# EAGLE design SOIC16 (EAGLE 6.0)
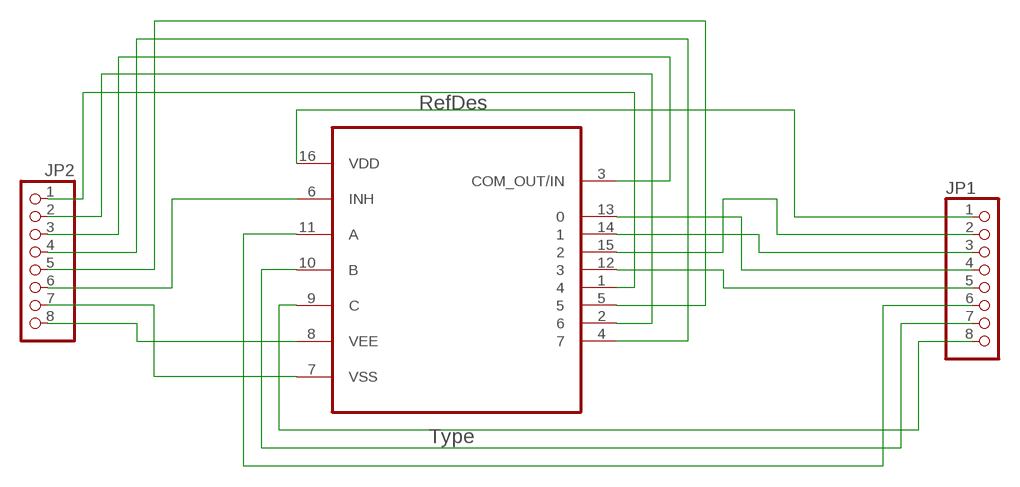
[diagram p0: schematic, sheet 1]

## Parts
JP1  PINHD-1X8  [1X08]
JP2  PINHD-1X8  [1X08]
U1  CD4051BM  [SOIC127P600X175-16N]

## Nets
N$1: JP2.1 U1.1
N$2: JP2.2 U1.2
N$3: JP2.3 U1.3(COM_OUT/IN)
N$4: JP2.4 U1.4
N$5: JP2.5 U1.5
N$6: JP2.6 U1.6(INH)
N$7: JP2.7 U1.7(VSS)
N$8: JP2.8 U1.8(VEE)
N$9: JP1.8 U1.9(C)
N$10: JP1.7 U1.10(B)
N$11: JP1.6 U1.11(A)
N$12: JP1.5 U1.12
N$13: JP1.4 U1.13
N$14: JP1.3 U1.14
N$15: JP1.2 U1.15
N$16: JP1.1 U1.16(VDD)

## Library data of the parts
JP1 JP2 = pinhead:PINHD-1X8: PIN HEADER
U1 = TI-CD4051BM:CD4051BM: CMOS Analog Multiplexers/Demultiplexers with Logic Level Conversion; DESCRIPTION: CMOS Analog Multiplexers/Demultiplexers with Logic Level Conversion; MPN: CD4051BM; OC_FARNELL: 8388970; OC_NEWARK: 05B5595; PACKAGE: SOIC-16; SUPPLIER: Texas Instruments

## Board
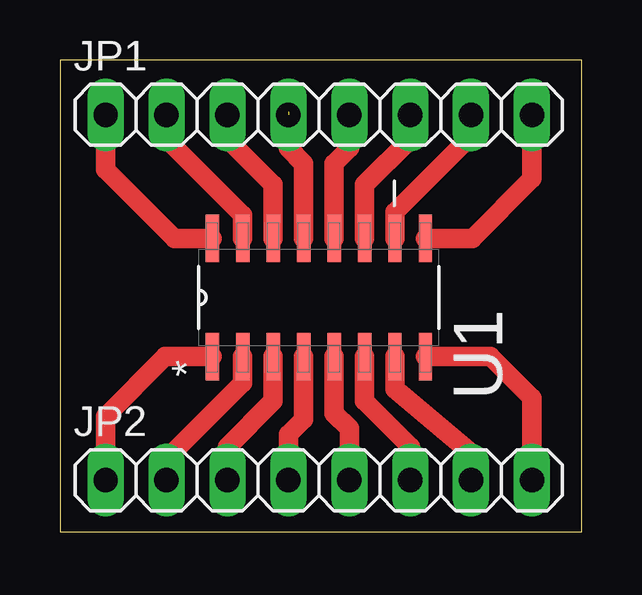
[diagram p1: board, top side]

Size 21.77 x 19.68 mm. Coordinates in mm from the lower left corner, seen from the top.
Outline: 0,0 21.77,0 21.77,19.68 0,19.68 0,0
Copper layers (1*16): Top 0.035mm / dielectric 1.5mm / Bottom 0.035mm
Design rules: minimum track width 10mil, minimum drill 24mil, track to track 8mil, track to pad 8mil, pad to pad 8mil, via to via 8mil, smd to smd 8mil, copper to edge 40mil, drill to drill 8mil, minimum pad ring 10mil, minimum via ring 8mil, stop-mask expansion 4mil, vias tented up to drill 0mil, thermal gap 10mil

### Footprints (pad centres in the part's own frame; a part is rotated, then mirrored left to right if it is on the bottom)
1X08 = drill 1.016 long: 1 -8.89,0; 2 -6.35,0; 3 -3.81,0; 4 -1.27,0; 5 1.27,0; 6 3.81,0; 7 6.35,0; 8 8.89,0
SOIC127P600X175-16N = smd 1.981 x 0.559: 1 -2.464,4.445; 2 -2.464,3.175; 3 -2.464,1.905; 4 -2.464,0.635; 5 -2.464,-0.635; 6 -2.464,-1.905; 7 -2.464,-3.175; 8 -2.464,-4.445; 9 2.464,-4.445; 10 2.464,-3.175; 11 2.464,-1.905; 12 2.464,-0.635; 13 2.464,0.635; 14 2.464,1.905; 15 2.464,3.175; 16 2.464,4.445

### Placement (x,y rotation side)
JP1  10.79,17.4 0 top
JP2  10.79,2.16 0 top
U1  10.79,9.78 90 top

### Tracks (layer width: path | path; a pad name or v marks a point on that pad's centre or on a via)
N$1
  Top 0.813: U1.1 4.39,7.32 1.91,4.83 JP2.1
N$2
  Top 0.813: U1.2 7.62,6.22 4.45,3.05 JP2.2
N$3
  Top 0.813: U1.3 8.89,5.46 6.99,3.56 JP2.3
N$4
  Top 0.813: U1.4 10.16,4.7 9.53,4.06 JP2.4
N$5
  Top 0.813: U1.5 11.43,4.95 12.06,4.32 JP2.5
N$6
  Top 0.813: U1.6 12.7,5.46 14.61,3.56 JP2.6
N$7
  Top 0.813: U1.7 13.97,5.97 17.14,3.3 JP2.7
N$8
  Top 0.813: U1.8 17.96,7.32 19.68,5.59 JP2.8
N$9
  Top 0.813: U1.9 17.2,12.24 19.68,14.73 JP1.8
N$10
  Top 0.813: U1.10 13.97,13.34 17.14,16.51 JP1.7
N$11
  Top 0.813: U1.11 12.7,14.48 14.61,16.38 JP1.6
N$12
  Top 0.813: U1.12 11.43,15.37 12.06,16 JP1.5
N$13  (1 unrouted)
  Top 0.813: U1.13 10.16,15.37 9.53,16 9.53,17.53
N$14
  Top 0.813: U1.14 8.89,14.48 6.99,16.38 JP1.3
N$15
  Top 0.813: U1.15 7.62,13.21 4.45,16.38 JP1.2
N$16
  Top 0.813: U1.16 4.78,12.24 1.91,15.11 JP1.1